# EAGLE design STM32F042_EVAL (EAGLE 7.4.0)
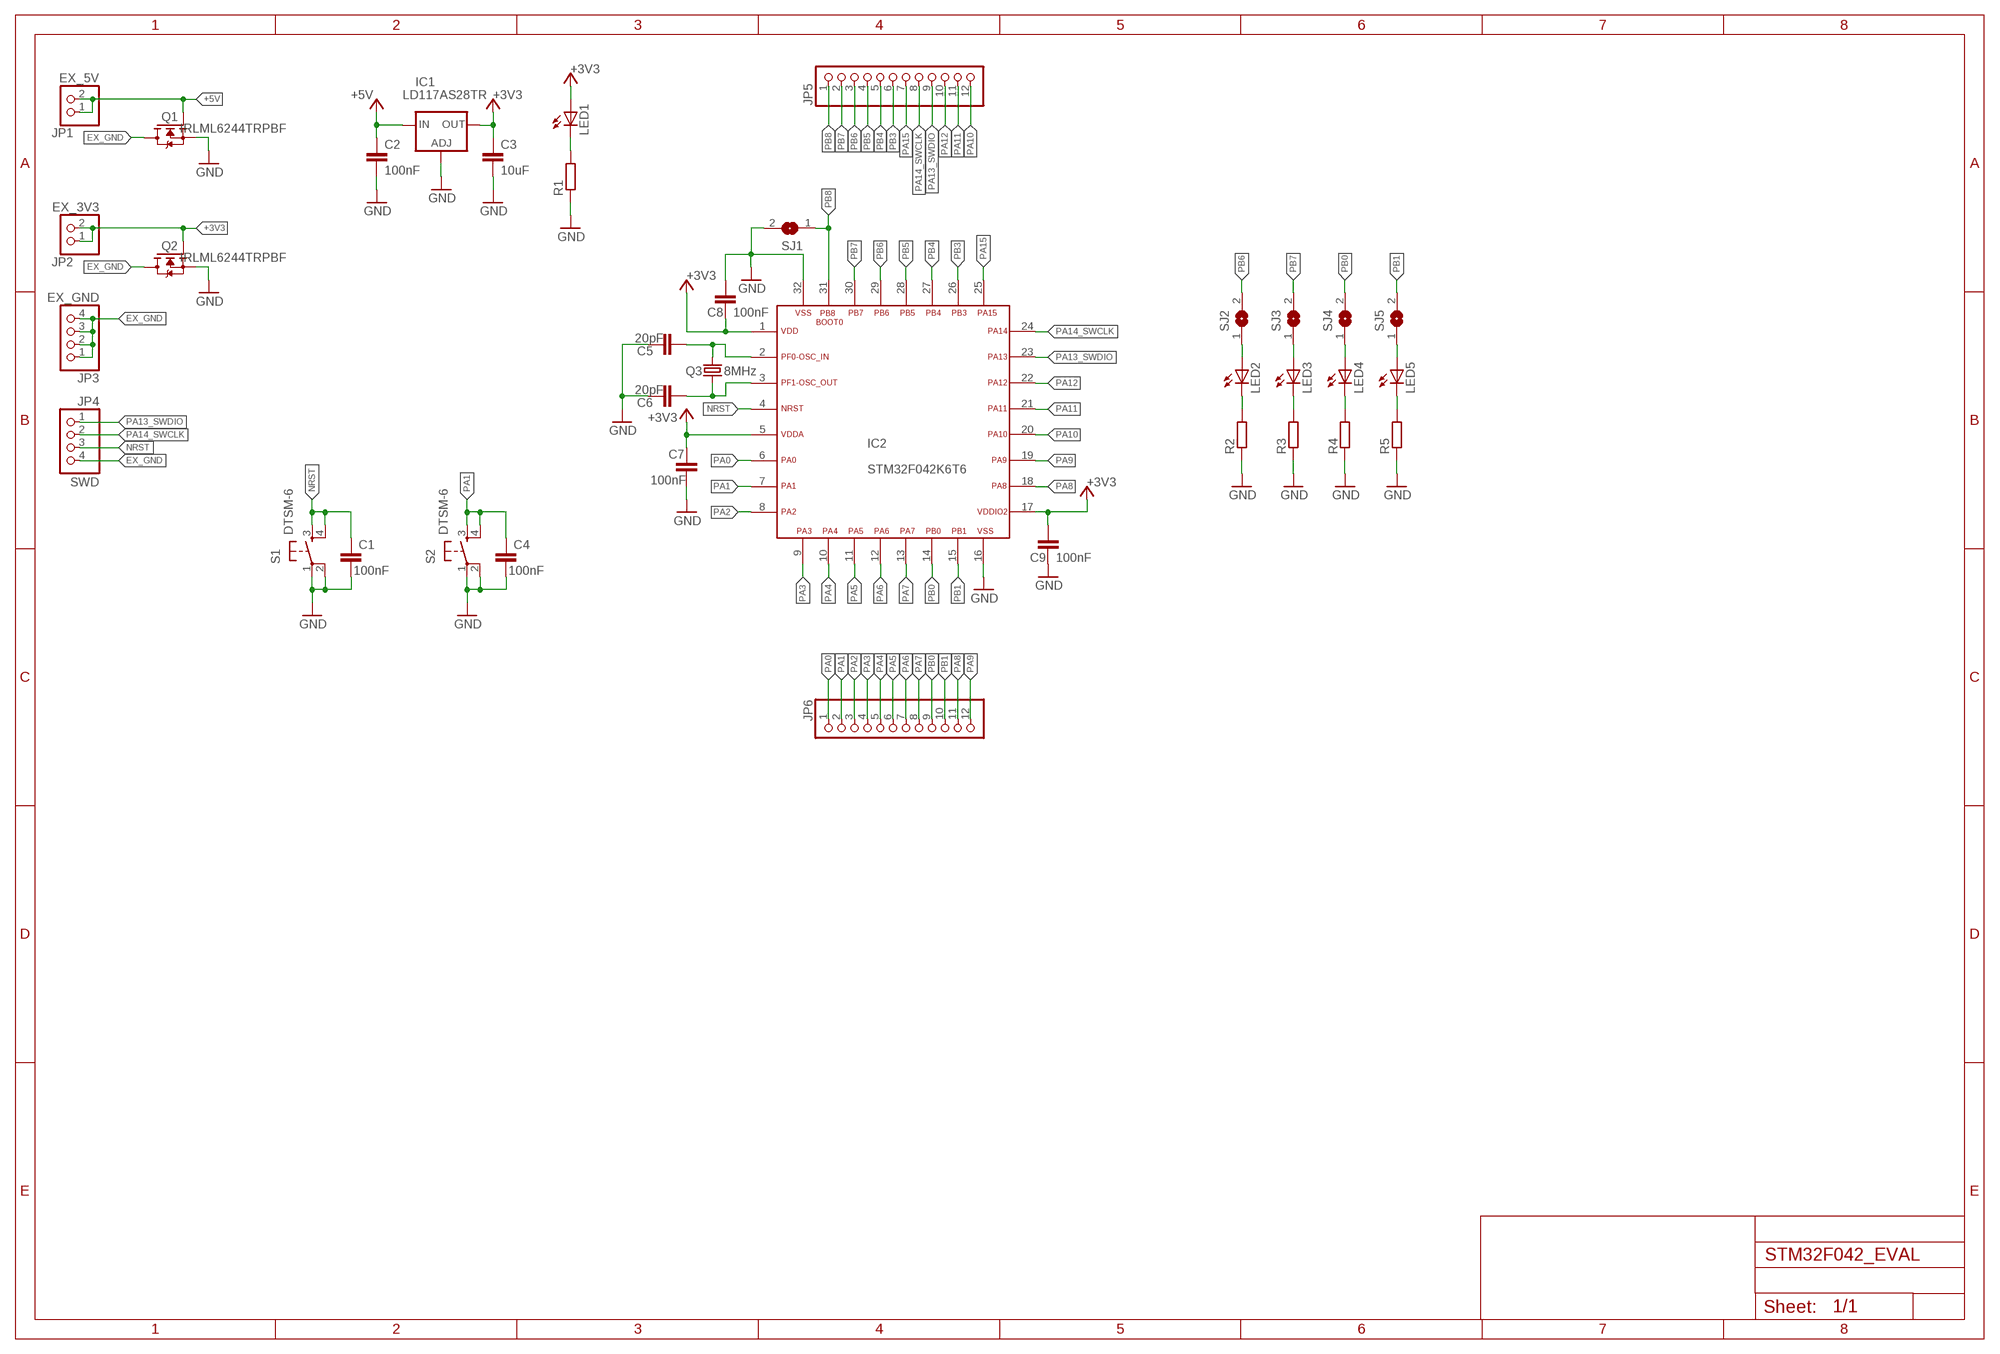
[diagram p0: schematic, sheet 1]

## Parts
C1  100nF  C-EUC0603  [C0603]
C2  100nF  C-EUC0603  [C0603]
C3  10uF  C-EUC0603  [C0603]
C4  100nF  C-EUC0603  [C0603]
C5  20pF  C-EUC0603  [C0603]
C6  20pF  C-EUC0603  [C0603]
C7  100nF  C-EUC0603  [C0603]
C8  100nF  C-EUC0603  [C0603]
C9  100nF  C-EUC0603  [C0603]
IC1  LD117AS28TR  [SOT223]
IC2  STM32F042K6T6  [LQFP32-7X7]
JP1  EX_5V  PINHD-1X2  [1X02]
JP2  EX_3V3  PINHD-1X2  [1X02]
JP3  EX_GND  PINHD-1X4  [1X04]
JP4  SWD  PINHD-1X4  [1X04]
JP5  PINHD-1X12  [1X12]
JP6  PINHD-1X12  [1X12]
LED1  LEDCHIP-LED0603  [CHIP-LED0603]
LED2  LEDCHIP-LED0603  [CHIP-LED0603]
LED3  LEDCHIP-LED0603  [CHIP-LED0603]
LED4  LEDCHIP-LED0603  [CHIP-LED0603]
LED5  LEDCHIP-LED0603  [CHIP-LED0603]
Q1  IRLML6244TRPBF  [SOT23]
Q2  IRLML6244TRPBF  [SOT23]
Q3  8MHz  CRYSTALHC49UP  [HC49UP]
R1  R-EU_R0603  [R0603]
R2  R-EU_R0805  [R0805]
R3  R-EU_R0805  [R0805]
R4  R-EU_R0805  [R0805]
R5  R-EU_R0805  [R0805]
S1  DTSM-6  [DTSM-6]
S2  DTSM-6  [DTSM-6]
SJ1  SJ  [SJ]
SJ2  SJ  [SJ]
SJ3  SJ  [SJ]
SJ4  SJ  [SJ]
SJ5  SJ  [SJ]

## Nets
+3V3: C3.1 C7.1 C8.2 C9.1 IC1.4(OUT) IC2.1(VDD) IC2.5(VDDA) IC2.17(VDDIO2) JP2.1 JP2.2 LED1.A Q2.1(G)
+5V: C2.1 IC1.3(IN) JP1.1 JP1.2 Q1.1(G)
EX_GND: JP3.1 JP3.2 JP3.3 JP3.4 JP4.4 Q1.3(D) Q2.3(D)
GND: C1.2 C2.2 C3.2 C4.2 C5.1 C6.1 C7.2 C8.1 C9.2 IC1.1(ADJ) IC2.16(VSS1) IC2.32(VSS2) Q1.2(S) Q2.2(S) R1.1 R2.1 R3.1 R4.1 R5.1 S1.1 S1.2 S2.1 S2.2 SJ1.2
N$1: LED1.C R1.2
N$2: LED2.C R2.2
N$3: LED3.C R3.2
N$4: LED4.C R4.2
N$5: LED5.C R5.2
N$6: LED2.A SJ2.1
N$7: LED3.A SJ3.1
N$8: LED4.A SJ4.1
N$9: LED5.A SJ5.1
N$29: C6.2 IC2.3(PF1-OSC_OUT) Q3.1
N$30: C5.2 IC2.2(PF0-OSC_IN) Q3.2
NRST: C1.1 IC2.4(NRST) JP4.3 S1.3 S1.4
PA0: IC2.6(PA0) JP6.1
PA1: C4.1 IC2.7(PA1) JP6.2 S2.3 S2.4
PA2: IC2.8(PA2) JP6.3
PA3: IC2.9(PA3) JP6.4
PA4: IC2.10(PA4) JP6.5
PA5: IC2.11(PA5) JP6.6
PA6: IC2.12(PA6) JP6.7
PA7: IC2.13(PA7) JP6.8
PA8: IC2.18(PA8) JP6.11
PA9: IC2.19(PA9) JP6.12
PA10: IC2.20(PA10) JP5.12
PA11: IC2.21(PA11) JP5.11
PA12: IC2.22(PA12) JP5.10
PA13_SWDIO: IC2.23(PA13) JP4.1 JP5.9
PA14_SWCLK: IC2.24(PA14) JP4.2 JP5.8
PA15: IC2.25(PA15) JP5.7
PB0: IC2.14(PB0) JP6.9 SJ4.2
PB1: IC2.15(PB1) JP6.10 SJ5.2
PB3: IC2.26(PB3) JP5.6
PB4: IC2.27(PB4) JP5.5
PB5: IC2.28(PB5) JP5.4
PB6: IC2.29(PB6) JP5.3 SJ2.2
PB7: IC2.30(PB7) JP5.2 SJ3.2
PB8: IC2.31(PB8-BOOT0) JP5.1 SJ1.1

## Library data of the parts
C1-C9 = rcl:C-EU: CAPACITOR, European symbol
IC1 = v-reg:LD117A?*: Low drop fixed and adjustable positive voltage regulators 1 A Source: http://www.st.com/stonline/products/literature/ds/7194/ld1117axx.pdf
IC2 = .my_elements:STM32F042
JP1 JP2 = pinhead:PINHD-1X2: PIN HEADER
JP3 JP4 = pinhead:PINHD-1X4: PIN HEADER
JP5 JP6 = pinhead:PINHD-1X12: PIN HEADER
LED1-LED5 = led:LED: LED OSRAM: - CHIPLED LG R971, LG N971, LY N971, LG Q971, LY Q971, LO R971, LY R971 LH N974, LH R974 LS Q976, LO Q976, LY Q976 LO Q996 - Hyper CHIPLED LW Q18S LB Q993, LB Q99A, LB R99A - SideLED LS A670, LO A670, LY A670, LG A670, LP A670 LB A673, LV A673, LT A673, LW A673 LH A674 LY A675 LS A676, LA A676, LO A676, LY A676, LW A676 LS A679, LY A679, LG A679 - Hyper Micro SIDELED® LS Y876, LA Y876, LO Y876, LY Y876 LT Y87S - SmartLED LW L88C, LW L88S LB L89C, LB L89S, LG L890 LS L89K, LO L89K, LY L89K LS L896, LA L896, LO L896, LY L896 - TOPLED LS T670, LO T670, LY T670, LG T670, LP T670 LSG T670, LSP T670, LSY T670, LOP T670, LYG T670 LG T671, LOG T671, LSG T671 LB T673, LV T673, LT T673, LW T673 LH T674 LS T676, LA T676, LO T676, LY T676, LB T676, LH T676, LSB T676, LW T676 LB T67C, LV T67C, LT T67C, LS T67K, LO T67K, LY T67K, LW E67C LS E67B, LA E67B, LO E67B, LY E67B, LB E67C, LV E67C, LT E67C LW T67C LS T679, LY T679, LG T679 LS T770, LO T770, LY T770, LG T770, LP T770 LB T773, LV T773, LT T773, LW T773 LH T774 LS E675, LA E675, LY E675, LS T675 LS T776, LA T776, LO T776, LY T776, LB T776 LHGB T686 LT T68C, LB T68C - Hyper Mini TOPLED® LB M676 - Mini TOPLED Santana® LG M470 LS M47K, LO M47K, LY M47K Source: http://www.osram.convergy.de LUXEON: - LUMILED® LXK2-PW12-R00, LXK2-PW12-S00, LXK2-PW14-U00, LXK2-PW14-V00 LXK2-PM12-R00, LXK2-PM12-S00, LXK2-PM14-U00 LXK2-PE12-Q00, LXK2-PE12-R00, LXK2-PE12-S00, LXK2-PE14-T00, LXK2-PE14-U00 LXK2-PB12-K00, LXK2-PB12-L00, LXK2-PB12-M00, LXK2-PB14-N00, LXK2-PB14-P00, LXK2-PB14-Q00 LXK2-PR12-L00, LXK2-PR12-M00, LXK2-PR14-Q00, LXK2-PR14-R00 LXK2-PD12-Q00, LXK2-PD12-R00, LXK2-PD12-S00 LXK2-PH12-R00, LXK2-PH12-S00 LXK2-PL12-P00, LXK2-PL12-Q00, LXK2-PL12-R00 Source: www.luxeon.com KINGBRIGHT: KA-3528ASYC Source: www.kingbright.com
Q1 Q2 = .my_elements:IRLML6244TRP
Q3 = crystal:CRYSTAL: CRYSTAL; OC_FARNELL: unknown; OC_NEWARK: unknown
R1-R5 = rcl:R-EU_: RESISTOR, European symbol
S1 S2 = switch-tact:DTSM-6
SJ1-SJ5 = jumper:SJ: SMD solder JUMPER

## Board
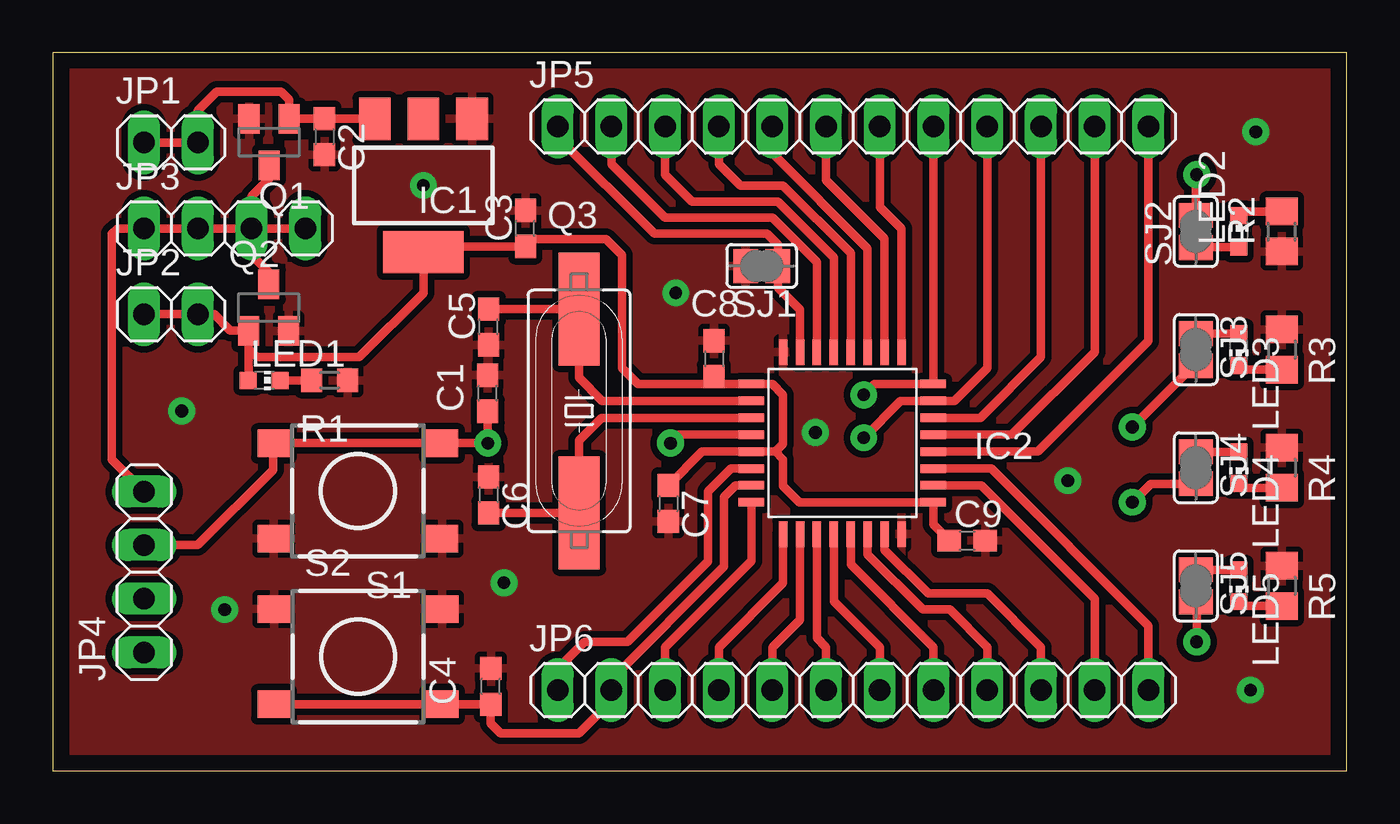
[diagram p1: board, top side]
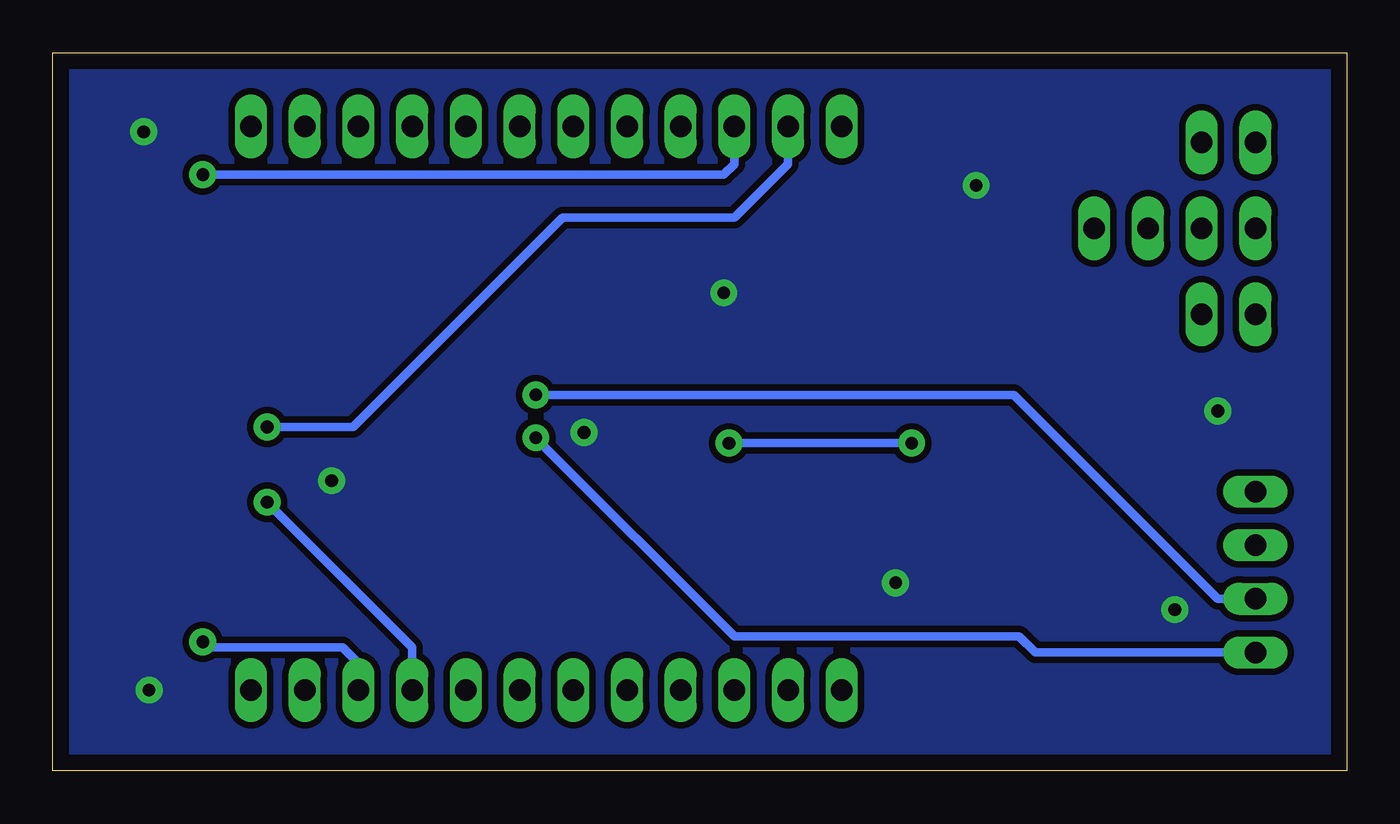
[diagram p2: board, bottom side, seen from below]

Size 61.19 x 33.96 mm. Coordinates in mm from the lower left corner, seen from the top.
Outline: 0,0 61.19,0 61.19,33.96 0,33.96 0,0
Copper layers (1*16): Top 0.035mm / dielectric 1.5mm / Bottom 0.035mm
Design rules "default *": minimum track width 10mil, minimum drill 0.5mm, track to track 10mil, track to pad 10mil, pad to pad 10mil, via to via 10mil, smd to smd 10mil, copper to edge 30mil, drill to drill 12mil, minimum pad ring 10mil, minimum via ring 8mil, stop-mask expansion 4mil, vias tented up to drill 0mil, thermal gap 10mil

### Footprints (pad centres in the part's own frame; a part is rotated, then mirrored left to right if it is on the bottom)
C0603 = smd 1.1 x 1: 1 -0.85,0; 2 0.85,0
SOT223 = smd 1.5 x 2: 1 -2.3,-3.15; 2 0,-3.15; 3 2.3,-3.15 | smd 3.8 x 2: 4 0,3.15
LQFP32-7X7 = smd 1.2 x 0.4: 1 -4.3,2.8; 2 -4.3,2; 3 -4.3,1.2; 4 -4.3,0.4; 5 -4.3,-0.4; 6 -4.3,-1.2; 7 -4.3,-2; 8 -4.3,-2.8; 17 4.3,-2.8; 18 4.3,-2; 19 4.3,-1.2; 20 4.3,-0.4; 21 4.3,0.4; 22 4.3,1.2; 23 4.3,2; 24 4.3,2.8 | smd 0.4 x 1.2: 9 -2.8,-4.3; 10 -2,-4.3; 11 -1.2,-4.3; 12 -0.4,-4.3; 13 0.4,-4.3; 14 1.2,-4.3; 15 2,-4.3; 16 2.8,-4.3; 25 2.8,4.3; 26 2,4.3; 27 1.2,4.3; 28 0.4,4.3; 29 -0.4,4.3; 30 -1.2,4.3; 31 -2,4.3; 32 -2.8,4.3
1X02 = drill 1.016 long: 1 -1.27,0; 2 1.27,0
1X04 = drill 1.016 long: 1 -3.81,0; 2 -1.27,0; 3 1.27,0; 4 3.81,0
1X12 = drill 1.016 long: 1 -13.97,0; 2 -11.43,0; 3 -8.89,0; 4 -6.35,0; 5 -3.81,0; 6 -1.27,0; 7 1.27,0; 8 3.81,0; 9 6.35,0; 10 8.89,0; 11 11.43,0; 12 13.97,0
CHIP-LED0603 = smd 0.8 x 0.8: A 0,-0.75; C 0,0.75
SOT23 = smd 1 x 1.4: 1 -0.95,-1.1; 2 0.95,-1.1; 3 0,1.1
HC49UP = smd 5.334 x 1.93: 1 -4.826,0; 2 4.826,0
R0603 = smd 1 x 1.1: 1 -0.85,0; 2 0.85,0
R0805 = smd 1.3 x 1.5: 1 -0.95,0; 2 0.95,0
DTSM-6 = smd 1.55 x 1.3: 1 -3.975,2.25; 2 3.975,2.25; 3 -3.975,-2.25; 4 3.975,-2.25
SJ = smd 1.168 x 1.6: 1 -0.762,0; 2 0.762,0

### Placement (x,y rotation side)
C1  20.57,17.86 90 top
C2  12.84,29.99 270 top
C3  22.35,25.65 90 top
C4  20.72,3.99 90 top
C5  20.61,20.99 90 top
C6  20.61,13.05 270 top
C7  29.11,12.64 270 top
C8  31.26,19.49 270 top
C9  43.25,10.88 0 top
IC1  17.53,27.69 180 top
IC2  37.34,15.49 0 top
JP1  5.59,29.72 0 top
JP2  5.59,21.59 0 top
JP3  8.13,25.65 0 top
JP4  4.32,9.4 90 top
JP5  37.85,30.48 0 top
JP6  37.85,3.81 0 top
LED1  10,18.46 270 top
LED2  56.09,25.51 0 top
LED3  56.09,19.92 180 top
LED4  56.09,14.33 180 top
LED5  56.09,8.75 180 top
Q1  10.22,29.74 180 top
Q2  10.21,21.9 0 top
Q3  24.89,17.02 90 top
R1  13.09,18.47 180 top
R2  58.12,25.51 90 top
R3  58.12,19.92 270 top
R4  58.12,14.33 270 top
R5  58.12,8.75 270 top
S1  14.43,13.23 180 top
S2  14.43,5.4 0 top
SJ1  33.53,23.88 180 top
SJ2  54.06,25.51 90 top
SJ3  54.06,19.92 270 top
SJ4  54.06,14.33 270 top
SJ5  54.06,8.75 270 top

### Tracks (layer width: path | path; a pad name or v marks a point on that pad's centre or on a via)
+3V3
  Top 0.406: C9.1 41.64,11.64 IC2.17 35.31,12.69 34.54,13.46 34.54,14.72 34.18,15.09 | 34.18,15.09 IC2.5 | IC2.5 | 34.18,15.09 34.54,15.46 34.54,17.78 34.03,18.29 IC2.1 31.62,18.29 C8.2 31.27,18.57 30.99,18.29 27.69,18.29 26.92,19.05 26.92,24.38 26.16,25.15 22.69,25.15 C3.1 17.79,24.8 IC1.4 17.53,22.61 14.48,19.56 9.65,19.56 9.26,19.95 Q2.1 | IC2.5 30.71,15.09 C7.1 | Q2.1 9.23,20.83 8.38,20.83 7.62,21.59 JP2.2 JP2.1 | Q2.1 9.26,18.47 LED1.A
+5V
  Top 0.406: JP1.1 JP1.2 6.86,31.23 7.76,32.13 10.8,32.13 11.18,31.75 Q1.1 C2.1 IC1.3
EX_GND
  Top 0.406: Q1.3 10.22,28 9.4,27.18 JP3.3 | Q2.3 10.21,23.58 9.4,24.38 JP3.3 | JP4.4 2.79,14.73 2.79,25.4 3.05,25.65 JP3.1 JP3.2 JP3.3 | JP3.3 JP3.4
GND  (via drill 0.6 pad 1.27)
  other vias: 36.07,16 17.53,27.69 6.1,17.02 21.34,8.89 56.9,30.23 56.64,3.81 48.01,13.72 8.13,7.62 29.46,22.61
  pour Top (isolate 0.305): 0.76,33.27 60.45,33.27 60.45,0.76 0.76,0.76
  pour Bottom (isolate 0.305): 0.76,33.27 60.45,33.27 60.45,0.76 0.76,0.76
N$1
  Top 0.406: LED1.C R1.2
N$2
  Top 0.406: LED2.C 56.29,26.46 R2.2
N$3
  Top 0.406: LED3.C 56.29,18.97 R3.2
N$4
  Top 0.406: LED4.C 56.29,13.38 R4.2
N$5
  Top 0.406: LED5.C 56.29,7.79 R5.2
N$6
  Top 0.406: SJ2.1 LED2.A
N$7
  Top 0.406: SJ3.1 LED3.A
N$8
  Top 0.406: SJ4.1 54.07,15.08 LED4.A
N$9
  Top 0.406: SJ5.1 54.07,9.49 LED5.A
N$29
  Top 0.406: IC2.3 25.96,16.69 24.88,15.62 Q3.1 C6.2
N$30
  Top 0.406: IC2.2 25.98,17.49 24.88,18.59 Q3.2 C5.2
NRST  (via drill 0.6 pad 1.27)
  Top 0.406: IC2.4 29.61,15.89 v29.21,15.49 | 18.41,15.49 v20.57,15.49 v20.57,15.5 C1.1 | 18.41,15.49 S1.3 | 18.41,15.49 10.46,15.49 S1.4 10.41,15.45 10.41,14.22 6.86,10.67 JP4.3
  Bottom 0.406: v29.21,15.49 v20.57,15.49
PA0
  Top 0.406: IC2.6 32.07,14.29 30.99,13.21 30.99,9.91 27.18,6.1 25.15,6.1 23.88,4.83 JP6.1
PA1
  Top 0.406: IC2.7 32.29,13.49 31.75,12.95 31.75,9.65 26.42,4.32 JP6.2 26.42,3.3 24.89,1.78 21.18,1.78 20.71,2.25 20.71,3.13 C4.1 S2.4 S2.3
PA2
  Top 0.406: IC2.8 33.04,9.92 28.96,5.84 JP6.3
PA3
  Top 0.406: IC2.9 34.54,8.88 31.5,5.84 JP6.4
PA4
  Top 0.406: IC2.10 35.34,7.14 34.04,5.84 JP6.5
PA5
  Top 0.406: IC2.11 36.14,6.28 36.58,5.84 JP6.6
PA6
  Top 0.406: IC2.12 36.94,8.02 39.12,5.84 JP6.7
PA7
  Top 0.406: IC2.13 37.74,9.76 41.66,5.84 JP6.8
PA8
  Top 0.406: IC2.18 43.91,13.49 49.28,8.13 JP6.11
PA9
  Top 0.406: IC2.19 44.38,14.29 51.82,6.86 JP6.12
PA10
  Top 0.406: IC2.20 46.59,15.09 51.82,20.32 JP5.12
PA11
  Top 0.406: IC2.21 45.36,15.89 49.28,19.81 JP5.11
PA12
  Top 0.406: IC2.22 43.87,16.69 46.74,19.56 JP5.10
PA13_SWDIO  (via drill 0.6 pad 1.27)
  Top 0.406: JP5.9 44.2,19.05 42.64,17.49 IC2.23 40.1,17.49 v38.35,15.75
  Bottom 0.406: v38.35,15.75 28.96,6.35 15.49,6.35 14.73,5.59 JP4.1
PA14_SWCLK  (via drill 0.6 pad 1.27)
  Top 0.406: JP5.8 41.64,30.46 IC2.24 38.87,18.29 v38.35,17.78
  Bottom 0.406: v38.35,17.78 15.75,17.78 6.1,8.13 JP4.2
PA15
  Top 0.406: IC2.25 40.14,25.65 39.12,26.67 JP5.7
PB0  (via drill 0.6 pad 1.27)
  Top 0.406: IC2.14 38.54,10.23 41.15,7.62 42.42,7.62 44.2,5.84 JP6.9 | SJ4.2 51.92,13.57 v51.05,12.7
  Bottom 0.406: v51.05,12.7 44.2,5.84 JP6.9
PB1  (via drill 0.6 pad 1.27)
  Top 0.406: IC2.15 39.34,10.45 41.4,8.38 44.2,8.38 46.74,5.84 JP6.10 | SJ5.2 54.1,7.94 v54.1,6.1
  Bottom 0.406: v54.1,6.1 53.85,5.84 47.5,5.84 46.74,5.08 JP6.10
PB3
  Top 0.406: IC2.26 39.34,25.18 36.58,27.94 JP5.6
PB4
  Top 0.406: IC2.27 38.54,24.71 34.04,29.21 JP5.5
PB5
  Top 0.406: IC2.28 37.74,24.49 34.54,27.69 32.51,27.69 31.5,28.7 JP5.4
PB6  (via drill 0.6 pad 1.27)
  Top 0.406: IC2.29 36.94,24.28 34.29,26.92 30.23,26.92 28.96,28.19 JP5.3 | SJ2.2 54.06,28.15 v54.1,28.19
  Bottom 0.406: v54.1,28.19 29.46,28.19 28.96,28.7 JP5.3
PB7  (via drill 0.6 pad 1.27)
  Top 0.406: IC2.30 36.14,24.06 34.04,26.16 28.96,26.16 26.42,28.7 JP5.2 | SJ3.2 53.96,19.16 v51.05,16.26
  Bottom 0.406: v51.05,16.26 46.99,16.26 37.08,26.16 28.96,26.16 26.42,28.7 JP5.2
PB8
  Top 0.406: IC2.31 35.34,21.81 34.29,22.86 SJ1.1 34.29,24.89 33.78,25.4 28.45,25.4 23.88,29.97 JP5.1

### Text on the board
tText: 5V | PB8 | PB7 | PB6 | PB5 | PB4 | PB3 | GND | PA15 | PA14 | PA13 | PA12 | PA11 | PA10 | LED2 | PWR / LED | STM32F042 / EVAL | 3V3 | LED3 | GND | LED4 | RST | CLK | LED5 | DIO | PA0 | PA1 | PA2 | PA3 | PA4 | PA5 | PA6 | PA7 | PB0 | PB1 | PA8 | PA9 | SWD | USER_SW